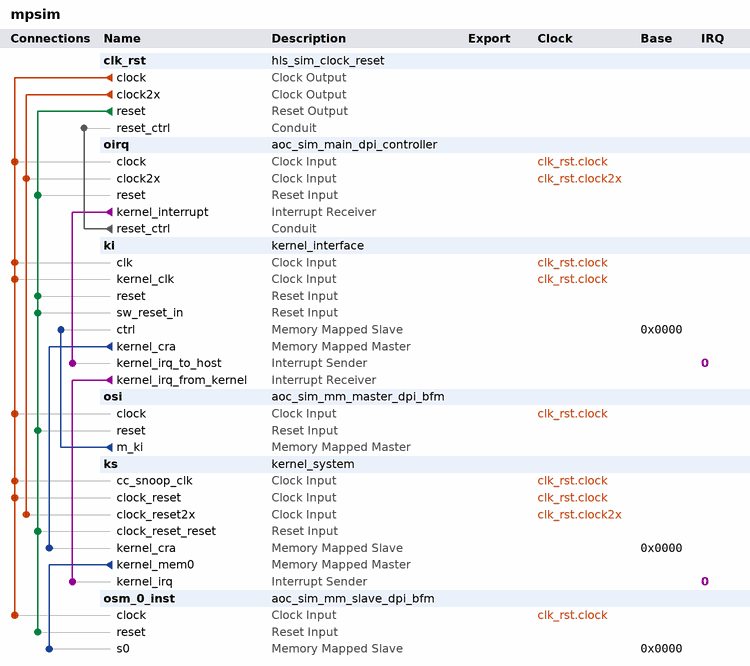
[diagram p0: system contents]
# Platform Designer (Qsys) system mpsim, Cyclone 10 GX 10CX085YF672E5G
# Parameters at their usual value, and those the tool derives, are not listed.
package require -exact qsys 1.0
create_system mpsim
set_project_property DEVICE_FAMILY {Cyclone 10 GX}
set_project_property DEVICE 10CX085YF672E5G

add_component clk_rst ip/mpsim/mpsim_clk_rst.ip hls_sim_clock_reset clk_rst 1.0
load_component clk_rst
set_component_parameter_value RESET_CYCLE_HOLD 120
save_component

add_component oirq ip/mpsim/mpsim_oirq.ip aoc_sim_main_dpi_controller oirq 1.0
load_component oirq
save_component

add_component ki ip/mpsim/mpsim_ki.ip kernel_interface ki 15.1
load_component ki
set_component_parameter_value NUM_GLOBAL_MEMS 1
set_component_parameter_value ENABLE_ROM_RECONFIGURE 1
set_component_parameter_value KERNEL_RESET_GLOBAL 1
save_component

add_component osi ip/mpsim/mpsim_osi.ip aoc_sim_mm_master_dpi_bfm osi 1.0
load_component osi
set_component_parameter_value KI_AV_ADDRESS_W 14
set_component_parameter_value KI_AV_SYMBOL_W 8
set_component_parameter_value KI_AV_NUMSYMBOLS 4
set_component_parameter_value KI_USE_WAIT_REQUEST 0
set_component_parameter_value MBD_AV_ADDRESS_W 31
set_component_parameter_value MBD_AV_SYMBOL_W 8
set_component_parameter_value MBD_AV_NUMSYMBOLS 4
set_component_parameter_value MBD_AV_BURSTSIZE 16
set_component_parameter_value MBD_USE_WAIT_REQUEST 1
set_component_parameter_value USE_READ 1
set_component_parameter_value USE_WRITE 1
set_component_parameter_value USE_ADDRESS 1
set_component_parameter_value USE_BYTE_ENABLE 1
set_component_parameter_value USE_READ_DATA 1
set_component_parameter_value USE_READ_DATA_VALID 1
set_component_parameter_value USE_WRITE_DATA 1
set_component_parameter_value AV_FIX_READ_LATENCY 0
set_component_parameter_value AV_READ_WAIT_TIME 0
set_component_parameter_value AV_WRITE_WAIT_TIME 0
set_component_parameter_value REGISTER_WAITREQUEST 0
set_component_parameter_value AV_REGISTERINCOMINGSIGNALS 0
set_component_parameter_value ADDRESS_UNITS SYMBOLS
set_component_parameter_value COMPONENT_NAME dut
save_component

add_component ks kernel_system.qsys kernel_system ks 

add_component osm_0_inst ip/mpsim/mm_slave_ks_kernel_mem0.ip aoc_sim_mm_slave_dpi_bfm osm_0_inst 1.0
load_component osm_0_inst
set_component_parameter_value AV_ADDRESS_W 31
set_component_parameter_value AV_SYMBOL_W 8
set_component_parameter_value AV_NUMSYMBOLS 64
set_component_parameter_value AV_BURSTCOUNT_W 5
set_component_parameter_value AV_READRESPONSE_W 8
set_component_parameter_value AV_WRITERESPONSE_W 8
set_component_parameter_value USE_READ 1
set_component_parameter_value USE_WRITE 1
set_component_parameter_value USE_ADDRESS 1
set_component_parameter_value USE_BYTE_ENABLE 1
set_component_parameter_value USE_BURSTCOUNT 1
set_component_parameter_value USE_READ_DATA 1
set_component_parameter_value USE_READ_DATA_VALID 1
set_component_parameter_value USE_WRITE_DATA 1
set_component_parameter_value USE_BEGIN_TRANSFER 0
set_component_parameter_value USE_BEGIN_BURST_TRANSFER 0
set_component_parameter_value USE_ARBITERLOCK 0
set_component_parameter_value USE_LOCK 0
set_component_parameter_value USE_DEBUGACCESS 0
set_component_parameter_value USE_WAIT_REQUEST 1
set_component_parameter_value USE_CLKEN 0
set_component_parameter_value ASSERT_HIGH_WAITREQUEST 1
set_component_parameter_value ASSERT_HIGH_READ 1
set_component_parameter_value ASSERT_HIGH_WRITE 1
set_component_parameter_value ASSERT_HIGH_BYTEENABLE 1
set_component_parameter_value ASSERT_HIGH_READDATAVALID 1
set_component_parameter_value ASSERT_HIGH_ARBITERLOCK 1
set_component_parameter_value ASSERT_HIGH_LOCK 1
set_component_parameter_value AV_BURST_LINEWRAP 1
set_component_parameter_value AV_BURST_BNDR_ONLY 1
set_component_parameter_value AV_MAX_PENDING_READS 256
set_component_parameter_value AV_MAX_PENDING_WRITES 0
set_component_parameter_value AV_FIX_READ_LATENCY 0
set_component_parameter_value AV_READ_WAIT_TIME 0
set_component_parameter_value AV_WRITE_WAIT_TIME 0
set_component_parameter_value REGISTER_WAITREQUEST 0
set_component_parameter_value AV_REGISTERINCOMINGSIGNALS 0
set_component_parameter_value AV_WAITREQUEST_ALLOWANCE 0
set_component_parameter_value ADDRESS_UNITS SYMBOLS
set_component_parameter_value COMPONENT_NAME avs
set_component_parameter_value INTERFACE_ID 0
save_component

# connections
add_connection clk_rst.clock ki.clk clock
add_connection clk_rst.clock ki.kernel_clk clock
add_connection clk_rst.clock ks.cc_snoop_clk clock
add_connection clk_rst.clock ks.clock_reset clock
add_connection clk_rst.clock oirq.clock clock
add_connection clk_rst.clock osi.clock clock
add_connection clk_rst.clock osm_0_inst.clock clock
add_connection clk_rst.clock2x ks.clock_reset2x clock
add_connection clk_rst.clock2x oirq.clock2x clock
add_connection clk_rst.reset ki.reset reset
add_connection clk_rst.reset ki.sw_reset_in reset
add_connection clk_rst.reset ks.clock_reset_reset reset
add_connection clk_rst.reset oirq.reset reset
add_connection clk_rst.reset osi.reset reset
add_connection clk_rst.reset osm_0_inst.reset reset
add_connection ki.kernel_cra ks.kernel_cra avalon
set_connection_parameter_value ki.kernel_cra/ks.kernel_cra baseAddress 0x0000
add_connection ks.kernel_mem0 osm_0_inst.s0 avalon
set_connection_parameter_value ks.kernel_mem0/osm_0_inst.s0 baseAddress 0x0000
add_connection osi.m_ki ki.ctrl avalon
set_connection_parameter_value osi.m_ki/ki.ctrl baseAddress 0x0000
add_connection oirq.reset_ctrl clk_rst.reset_ctrl conduit
add_connection ki.kernel_irq_from_kernel ks.kernel_irq interrupt
set_connection_parameter_value ki.kernel_irq_from_kernel/ks.kernel_irq irqNumber 0
add_connection oirq.kernel_interrupt ki.kernel_irq_to_host interrupt
set_connection_parameter_value oirq.kernel_interrupt/ki.kernel_irq_to_host irqNumber 0

save_system mpsim.qsys
